# EAGLE design AT24-Timer (EAGLE 7.5.0)
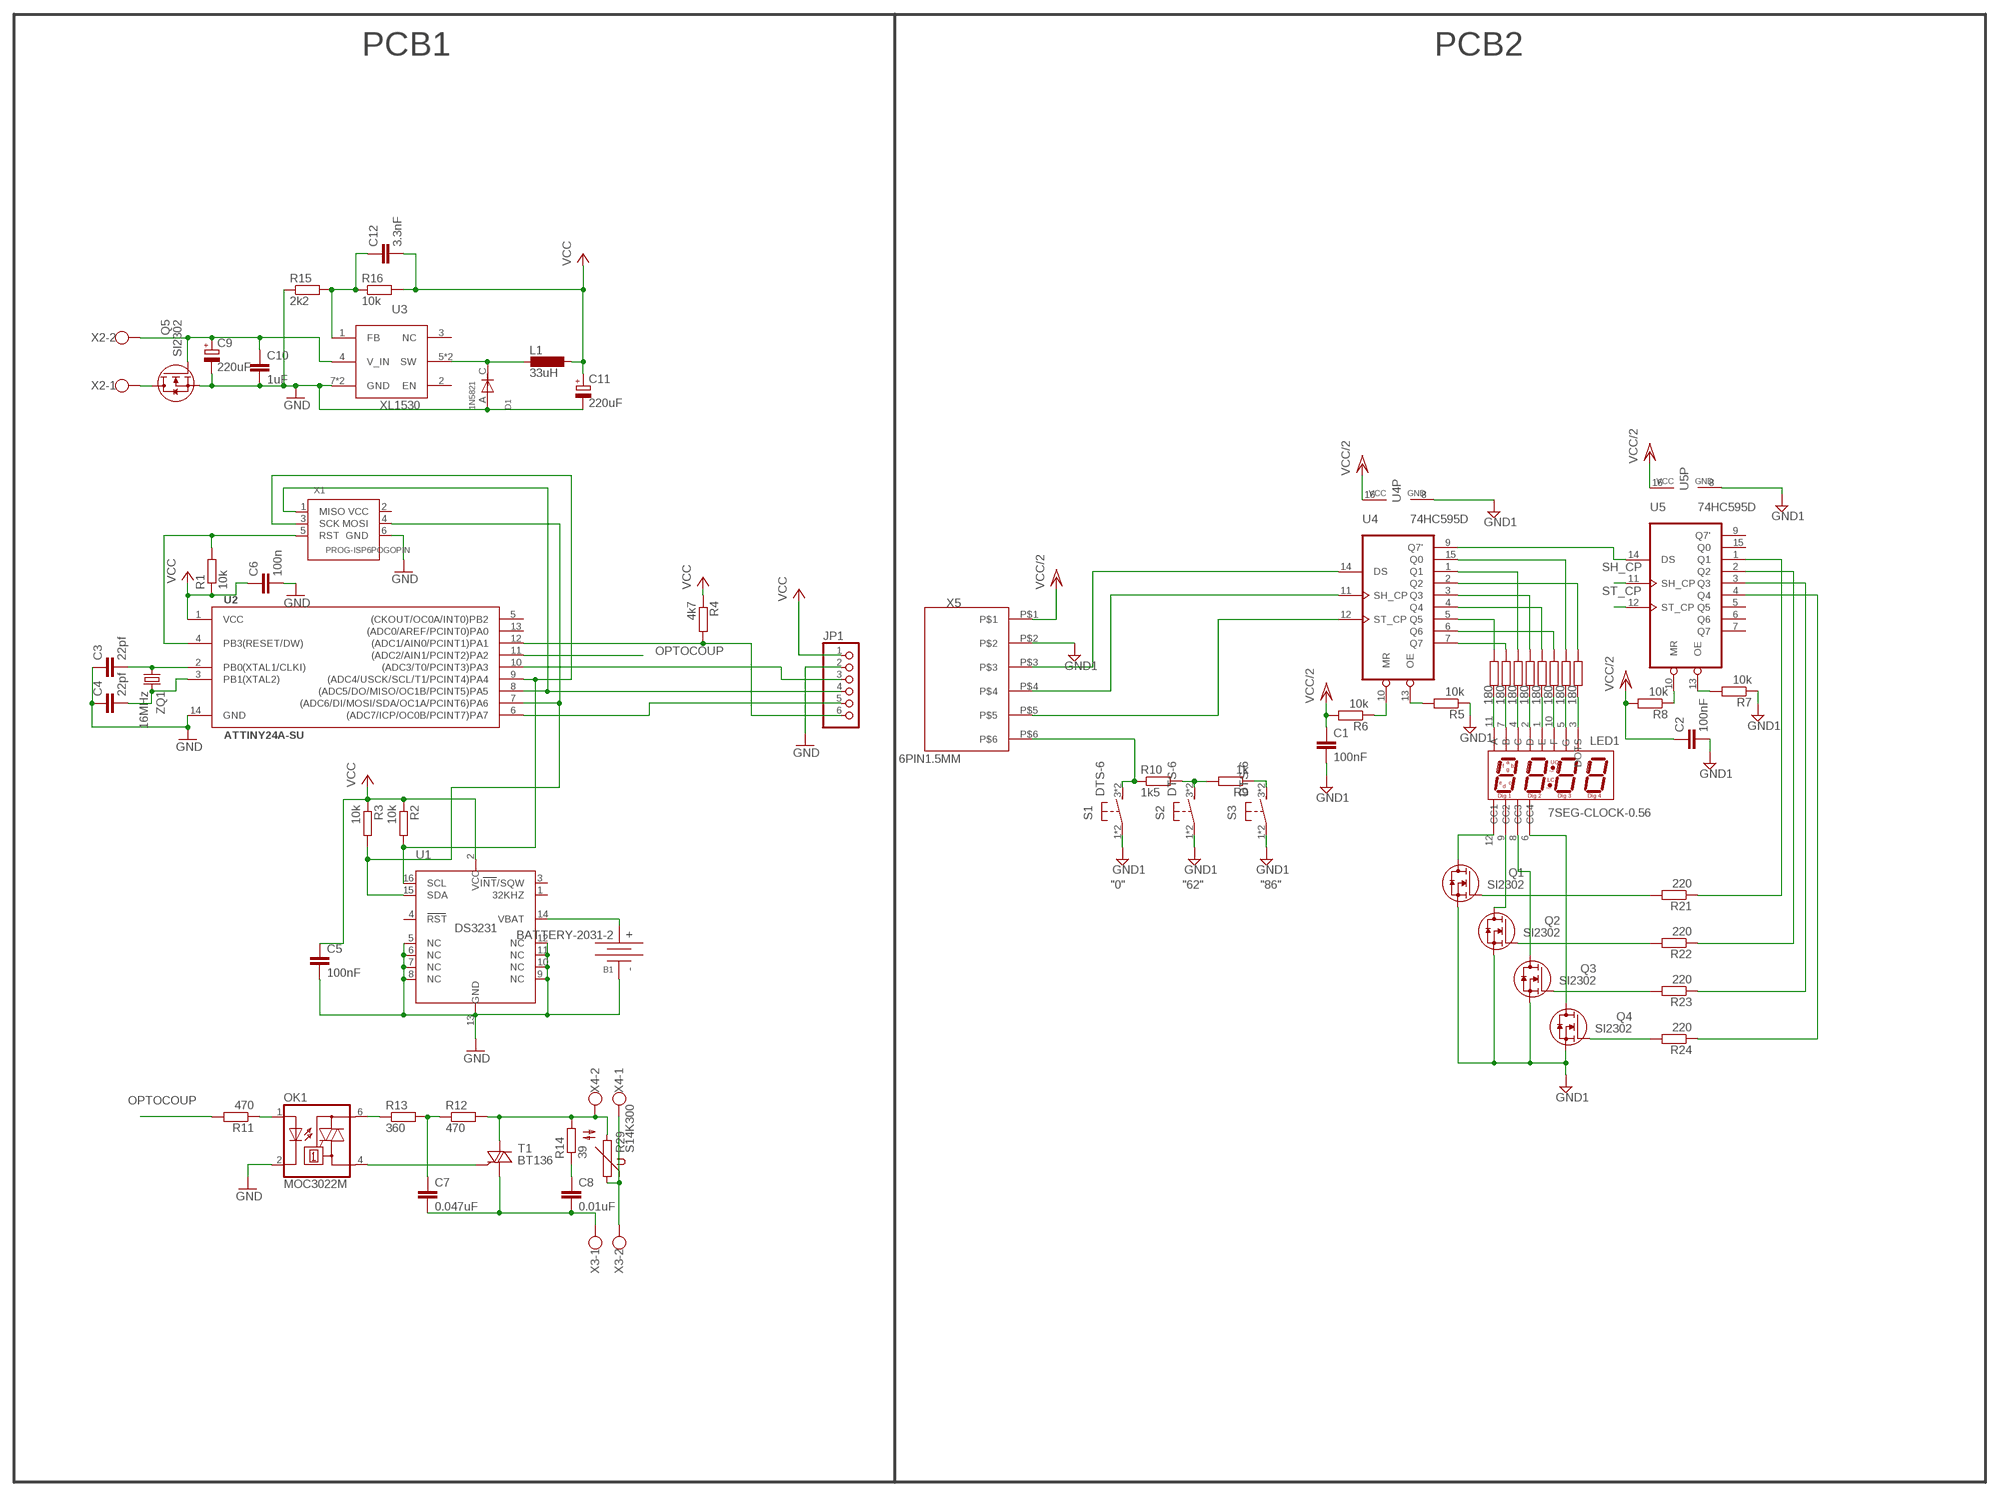
[diagram p0: schematic, sheet 1]

## Parts
B1  BATTERY-2031-2  [BTH2032-2]
C1  100nF  C-EUC0603  [C0603]
C2  100nF  C-EUC0603  [C0603]
C3  22pf  C-EUC0603  [C0603]
C4  22pf  C-EUC0603  [C0603]
C5  100nF  C-EUC0603  [C0603]
C6  100n  C-EUC0603  [C0603]
C7  0.047uF  C-EU150-054X183  [C150-054X183]
C8  0.01uF  C-EU102-043X133  [C102-043X133]
C9  220uF  CPOL-EUE2,5-6E  [E2,5-6E]
C10  1uF  C-EUC0805  [C0805]
C11  220uF  CPOL-EUE2,5-6E  [E2,5-6E]
C12  3.3nF  C-EUC0805  [C0805]
D1  1N5821  DIODESMD  [DO214AC]
JP1  PINHD-1X6  [1X06]
L1  33uH  L-SMD  [L-SMD-D10]
LED1  7SEG-CLOCK-0.56  [7SEG_4DIG_0.56]
OK1  MOC3022M  [DIL06]
Q1  SI2302  [SOT-23-GSD]
Q2  SI2302  [SOT-23-GSD]
Q3  SI2302  [SOT-23-GSD]
Q4  SI2302  [SOT-23-GSD]
Q5  SI2302  [SOT-23-GSD]
R1  10k  R-EU_R0805  [R0805]
R2  10k  R-EU_R0805  [R0805]
R3  10k  R-EU_R0805  [R0805]
R4  4k7  R-EU_R0805  [R0805]
R5  10k  R-EU_R0805  [R0805]
R6  10k  R-EU_R0805  [R0805]
R7  10k  R-EU_R0805  [R0805]
R8  10k  R-EU_R0805  [R0805]
R9  1k  R-EU_R0805  [R0805]
R10  1k5  R-EU_R0805  [R0805]
R11  470  R-EU_R0805  [R0805]
R12  470  R-EU_0207/7  [0207/7]
R13  360  R-EU_0207/7  [0207/7]
R14  39  R-EU_0207/7  [0207/7]
R15  2k2  R-EU_R0603  [R0603]
R16  10k  R-EU_R0603  [R0603]
R17  180  R-EU_R0805  [R0805]
R18  180  R-EU_R0805  [R0805]
R19  180  R-EU_R0805  [R0805]
R20  180  R-EU_R0805  [R0805]
R21  220  R-EU_R0805  [R0805]
R22  220  R-EU_R0805  [R0805]
R23  220  R-EU_R0805  [R0805]
R24  220  R-EU_R0805  [R0805]
R25  180  R-EU_R0805  [R0805]
R26  180  R-EU_R0805  [R0805]
R27  180  R-EU_R0805  [R0805]
R28  180  R-EU_R0805  [R0805]
R29  S14K300  [S14K300]
S1  DTS-6  [DTS-6]
S2  DTS-6  [DTS-6]
S3  DTS-6  [DTS-6]
T1  BT136  [TO220AB]
U1  DS3231  [SO16L]
U2  ATTINY24A-SU  [SO14]
U3  XL1530  [SOP08]
U4  74HC595D  [SO16]
U5  74HC595D  [SO16]
X1  PROG-ISP6POGOPIN  [PROG_POGOPIN]
X2  W237-102  [W237-102]
X3  W237-102  [W237-102]
X4  W237-102  [W237-102]
X5  6PIN1.5MM  [6PIN*1.5MM]
ZQ1  16MHz  CRYSTALHC49S  [HC49/S]

## Nets
GND: B1.- C3.1 C4.1 C5.2 C6.2 C9.- C10.2 C11.- D1.A(ANOD) JP1.2 OK1.2(C) Q5.S R15.1 U1.5(NC) U1.6(NC) U1.7(NC) U1.8(NC) U1.9(NC) U1.10(NC) U1.11(NC) U1.12(NC) U1.13(GND) U2.14(GND) U3.7(GND) U3.8(GND) X1.6(GND)
GND1: C1.2 C2.2 Q1.S Q2.S Q3.S Q4.S R5.1 R7.1 S1.1 S1.2 S2.1 S2.2 S3.1 S3.2 U4.8(GND) U5.8(GND) X5.P$2
N$1: R29.1 X3.2 X4.1
N$2: Q5.D X2.1
N$3: R3.2 U1.15(SDA) U2.7((ADC6/DI/MOSI/SDA/OC1A/PCINT6)PA6) X1.4(MOSI)
N$4: R2.2 U1.16(SCL) U2.9((ADC4/USCK/SCL/T1/PCINT4)PA4) X1.3(SCK)
N$5: R1.2 U2.4(PB3(RESET/DW)) X1.5(RST)
N$6: R10.1 S1.3 S1.4 X5.P$6
N$7: C3.2 U2.2(PB0(XTAL1/CLKI)) ZQ1.1
N$8: C4.2 U2.3(PB1(XTAL2)) ZQ1.2
N$9: R6.1 U4.10(MR)
N$10: JP1.6 R4.2 U2.12((ADC1/AIN0/PCINT1)PA1)
N$11: U4.14(DS) X5.P$3
N$12: C8.1 R14.1
N$13: C7.2 C8.2 T1.1(A1) X3.1
N$14: R12.2 R14.2 R29.2 T1.2(A2) X4.2
N$16: R9.1 S3.3 S3.4
N$17: OK1.4(A1) T1.3(G)
N$18: C7.1 R12.1 R13.2
N$19: OK1.6(A2) R13.1
N$20: R5.2 U4.13(OE)
N$21: OK1.1(A) R11.1
N$22: R8.1 U5.10(MR)
N$23: JP1.5 U2.6((ADC7/ICP/OC0B/PCINT7)PA7)
N$24: JP1.4 U2.8((ADC5/DO/MISO/OC1B/PCINT5)PA5) X1.1(MISO)
N$25: R7.2 U5.13(OE)
N$27: JP1.3 U2.10((ADC3/T0/PCINT3)PA3)
N$28: R17.1 U4.5(Q5)
N$29: R18.1 U4.7(Q7)
N$30: U4.9(Q7') U5.14(DS)
N$31: R19.1 U4.1(Q1)
N$32: R20.1 U4.3(Q3)
N$33: R25.1 U4.4(Q4)
N$34: R26.1 U4.6(Q6)
N$35: R27.1 U4.15(Q0)
N$36: R28.1 U4.2(Q2)
N$37: LED1.12(CC1) Q1.D
N$38: LED1.9(CC2) Q2.D
N$39: LED1.8(CC3) Q3.D
N$40: LED1.6(CC4) Q4.D
N$41: R21.1 U5.1(Q1)
N$42: R22.1 U5.2(Q2)
N$43: R23.1 U5.3(Q3)
N$44: R24.1 U5.4(Q4)
N$49: C9.+ C10.1 Q5.G U3.4(V_IN) X2.2
N$51: LED1.11(A) R17.2
N$52: LED1.7(B) R18.2
N$53: C12.1 R15.2 R16.1 U3.1(FB)
N$54: D1.C(KATOD) L1.P$2 U3.5(SW) U3.6(SW)
N$55: LED1.4(C) R19.2
N$56: B1.+ U1.14(VBAT)
N$57: LED1.2(D) R20.2
N$58: LED1.1(E) R25.2
N$59: LED1.10(F) R26.2
N$60: LED1.5(G) R27.2
N$61: LED1.3(DOTS) R28.2
N$65: Q4.G R24.2
N$66: Q3.G R23.2
N$67: Q2.G R22.2
N$68: Q1.G R21.2
N$160: R9.2 R10.2 S2.3 S2.4
OPTOCOUP: R11.2 U2.11((ADC2/AIN1/PCINT2)PA2)
SH_CP: U4.11(SH_CP) U5.11(SH_CP) X5.P$4
ST_CP: U4.12(ST_CP) U5.12(ST_CP) X5.P$5
VCC: C5.1 C6.1 C11.+ C12.2 JP1.1 L1.P$1 R1.1 R2.1 R3.1 R4.1 R16.2 U1.2(VCC) U2.1(VCC)
VCC/2: C1.1 C2.1 R6.2 R8.2 U4.16(VCC) U5.16(VCC) X5.P$1
Unconnected: U1.1(32KHZ) U1.3(INT/SQW) U1.4(RST) U2.5((CKOUT/OC0A/INT0)PB2) U2.13((ADC0/AREF/PCINT0)PA0) U3.2(EN) U3.3(NC) U5.5(Q5) U5.6(Q6) U5.7(Q7) U5.9(Q7') U5.15(Q0) X1.2(VCC)

## Notes on the sheet
- PCB1 | PCB2
- "0" | "62" | "86"

## Library data of the parts
B1 = usb:BATTERY
C1-C8 C10 C12 = rcl:C-EU: CAPACITOR, European symbol
C9 C11 = rcl:CPOL-EU: POLARIZED CAPACITOR, European symbol
D1 = usb:DIODE: DIODE
JP1 = pinhead:PINHD-1X6: PIN HEADER
L1 = usb:L-SMD
LED1 = usb:7SEG-CLOCK-0.56
OK1 = optocoupler:MOC30*M: RANDOM-PHASE OPTOISOLATORS TRIAC DRIVER OUTPUT Source: http://www.fairchildsemi.com MOC3020-M.pdf; MF: FAIRCHILD SEMICONDUCTOR; MPN: MOC3022-M; OC_FARNELL: 1021086; OC_NEWARK: 58K1956
Q1-Q5 = usb:SI2302: N-канальный полевик
R1-R28 = rcl:R-EU_: RESISTOR, European symbol
R29 = varistor:S14K300: VARISTOR
S1-S3 = switch-tact:DTS-6
T1 = triac:BT136: Triac BT136 series E sensitive gate Source: http://www.nxp.com/acrobat_download/datasheets/BT136_SERIES_E_2.pdf
U1 = usb:DS3231: Real-Time Clock DS3231
U2 = usb:ATTINY24A: ATTiny24A ATTiny44A ATTiny84A
U3 = usb:XL1530
U4 U5 = 74xx-eu:74*595: 8-bit SHIFT REGISTER, output latch
X1 = usb:PROG-ISP
X2-X4 = con-wago-500:W237-102: WAGO SCREW CLAMP; MPN: 237-102; OC_FARNELL: unknown; OC_NEWARK: 70K9898
X5 = usb:6PIN*1.5MM
ZQ1 = crystal:CRYSTAL: CRYSTAL; OC_FARNELL: 1667008; OC_NEWARK: unknown

## Board
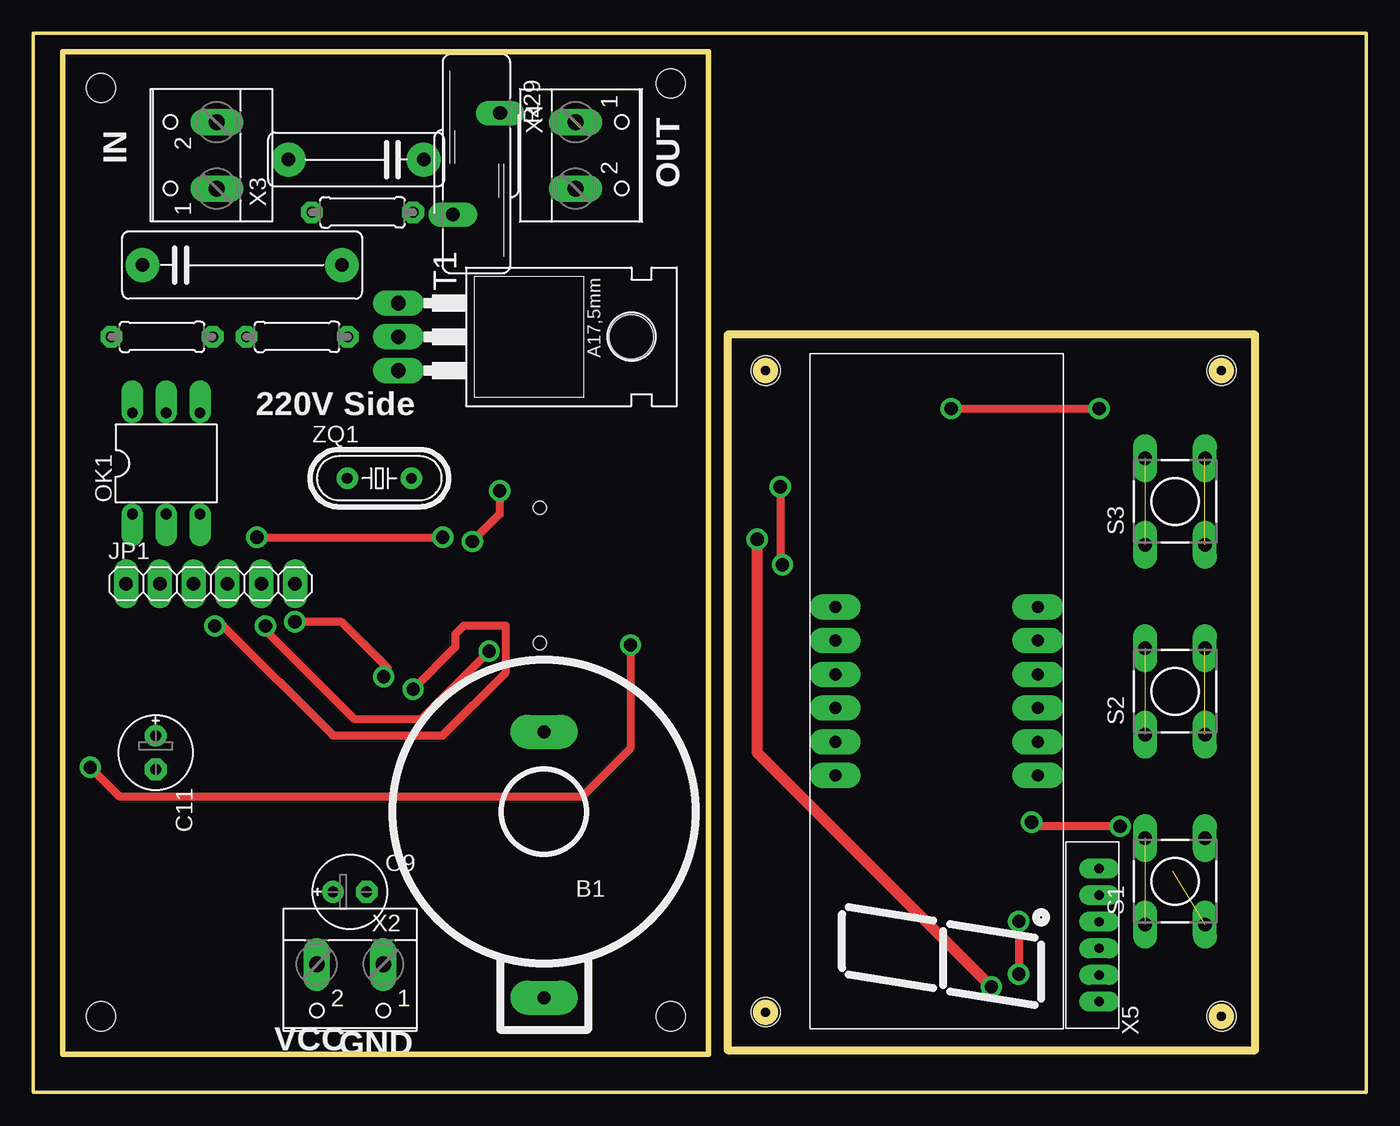
[diagram p1: board, top side]
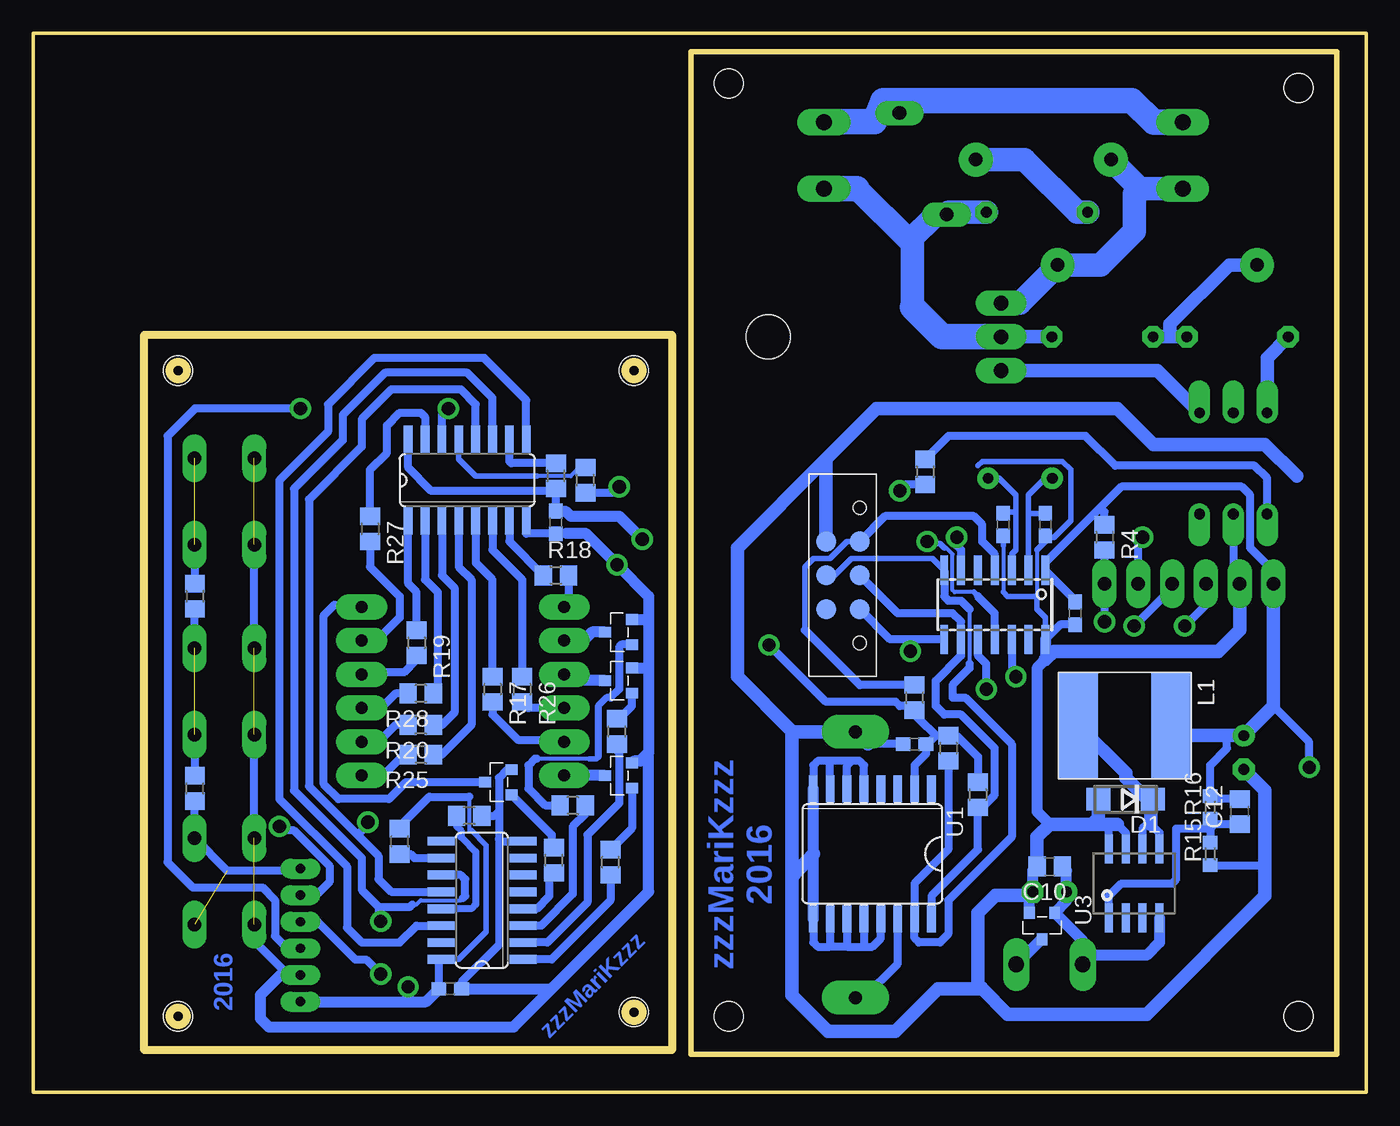
[diagram p2: board, bottom side, seen from below]

Size 100.27 x 79.67 mm. Coordinates in mm from the lower left corner, seen from the top.
Outline: 0,0 100.27,0 100.27,79.67 0,79.67 0,0
Outline: 2.22,2.86 50.8,2.86 50.8,78.26 2.22,78.26 2.22,2.86
Outline: 91.92,3.17 91.92,56.99 52.23,56.99 52.23,3.17 91.92,3.17
Outline: circle at 89.38,5.71 radius 0.64
Outline: circle at 55.09,6.03 radius 0.64
Outline: circle at 55.09,54.29 radius 0.64
Outline: circle at 89.38,54.29 radius 0.64
Copper layers (1*16): Top 0.035mm / dielectric 1.5mm / Bottom 0.035mm
Design rules "default *": minimum track width 12mil, minimum drill 20mil, track to track 12mil, track to pad 12mil, pad to pad 12mil, via to via 12mil, smd to smd 8mil, copper to edge 20mil, drill to drill 8mil, minimum pad ring 16mil, minimum via ring 12mil, stop-mask expansion 4mil, vias tented up to drill 0mil, thermal gap 20mil
Holes 2.2 mm at 5.08,5.71 47.94,5.71 47.94,75.88 5.08,75.56 55.09,6.03 55.09,54.29 89.38,54.29 89.38,5.71

### Footprints (pad centres in the part's own frame; a part is rotated, then mirrored left to right if it is on the bottom)
BTH2032-2 = drill 1 pad 2.54 long: + 0,-14; - 0,6
C0603 = smd 1.1 x 1: 1 -0.85,0; 2 0.85,0
C150-054X183 = drill 1.016 pad 2.54: 1 -7.493,0; 2 7.493,0
C102-043X133 = drill 1.016 pad 2.54: 1 -5.08,0; 2 5.08,0
E2,5-6E = drill 0.813 pad 1.575: + -1.27,0 | drill 0.813 pad 1.575 octagon: - 1.27,0
C0805 = smd 1.3 x 1.5: 1 -0.95,0; 2 0.95,0
DO214AC = smd 1.8 x 1.7: A 2.05,0; C -2.05,0
1X06 = drill 1.016 long: 1 -6.35,0; 2 -3.81,0; 3 -1.27,0; 4 1.27,0; 5 3.81,0; 6 6.35,0
L-SMD-D10 = smd 8 x 3: P$1 4,8.5; P$2 4,1.5
7SEG_4DIG_0.56 = drill 0.9 pad 1.93 long: 1 -5.08,-2.54; 2 -2.54,-2.54; 3 0,-2.54; 4 2.54,-2.54; 5 5.08,-2.54; 6 7.62,-2.54; 7 7.62,12.7; 8 5.08,12.7; 9 2.54,12.7; 10 0,12.7; 11 -2.54,12.7; 12 -5.08,12.7
DIL06 = drill 0.813 offset: 1 -2.54,-3.81; 2 0,-3.81; 3 2.54,-3.81; 4 2.54,3.81; 5 0,3.81; 6 -2.54,3.81
SOT-23-GSD = smd 0.8 x 0.9: D 0,2; G -0.95,0; S 0.95,0
R0805 = smd 1.3 x 1.5: 1 -0.95,0; 2 0.95,0
0207/7 = drill 0.813 octagon: 1 -3.81,0; 2 3.81,0
R0603 = smd 1 x 1.1: 1 -0.85,0; 2 0.85,0
S14K300 = drill 1.016 long: 1 -1.778,-3.81; 2 1.778,3.81
DTS-6 = drill 1 long: 1 -3.25,2.25; 2 3.25,2.25; 3 -3.25,-2.25; 4 3.25,-2.25
TO220AB = drill 1.118 long: 1 -2.54,-6.35; 2 0,-6.35; 3 2.54,-6.35 | hole 3.302: 0,11.176
SO16L = smd 0.66 x 2.032: 1 -4.445,-4.902; 2 -3.175,-4.902; 3 -1.905,-4.902; 4 -0.635,-4.902; 5 0.635,-4.902; 6 1.905,-4.902; 7 3.175,-4.902; 8 4.445,-4.902; 9 4.445,4.902; 10 3.175,4.902; 11 1.905,4.902; 12 0.635,4.902; 13 -0.635,4.902; 14 -1.905,4.902; 15 -3.175,4.902; 16 -4.445,4.902
SO14 = smd 0.6 x 2.2: 1 -3.81,-2.6; 2 -2.54,-2.6; 3 -1.27,-2.6; 4 0,-2.6; 5 1.27,-2.6; 6 2.54,-2.6; 7 3.81,-2.6; 8 3.81,2.6; 9 2.54,2.6; 10 1.27,2.6; 11 0,2.6; 12 -1.27,2.6; 13 -2.54,2.6; 14 -3.81,2.6
SOP08 = smd 0.6 x 2.2: 1 -1.905,-2.6; 2 -0.635,-2.6; 3 0.635,-2.6; 4 1.905,-2.6; 5 1.905,2.6; 6 0.635,2.6; 7 -0.635,2.6; 8 -1.905,2.6
SO16 = smd 0.66 x 2.032: 1 -4.445,-3.073; 2 -3.175,-3.073; 3 -1.905,-3.073; 4 -0.635,-3.073; 5 0.635,-3.073; 6 1.905,-3.073; 7 3.175,-3.073; 8 4.445,-3.073; 9 4.445,3.073; 10 3.175,3.073; 11 1.905,3.073; 12 0.635,3.073; 13 -0.635,3.073; 14 -1.905,3.073; 15 -3.175,3.073; 16 -4.445,3.073
PROG_POGOPIN = smd 1.524 x 1.524: 1 0,7.62; 2 2.54,7.62; 3 0,5.08; 4 2.54,5.08; 5 0,2.54; 6 2.54,2.54 | hole 1.016: 0,0; 0,10.16
W237-102 = drill 1.194 long: 1 -2.5,-1.27; 2 2.5,-1.27
6PIN*1.5MM = drill 0.7 long: P$1 0,0; P$2 0,2; P$3 0,4; P$4 0,6; P$5 0,8; P$6 0,10
HC49/S = drill 0.813: 1 -2.413,0; 2 2.413,0

### Placement (x,y rotation side)
B1  38.42,21.11 0 top
C1  68.9,7.79 0 bottom
C2  60.96,42.88 270 bottom
C3  24.13,42.7 90 bottom
C4  27.3,42.7 90 bottom
C5  33.97,26.19 180 bottom
C6  21.91,36.04 270 bottom
C7  15.72,62.23 0 top
C8  24.29,70.17 180 top
C9  23.81,15.08 0 top
C10  23.81,16.99 180 bottom
C11  9.21,25.56 270 top
C12  9.53,21.11 90 bottom
D1  18.1,22.07 180 bottom
JP1  13.34,38.26 0 top
L1  23.18,31.59 270 bottom
LED1  73.03,28.91 90 top
OK1  10,47.31 0 top
Q1  55.24,23.83 90 bottom
Q2  55.24,30.97 90 bottom
Q3  55.24,34.62 90 bottom
Q4  64.29,23.32 90 bottom
Q5  24.39,13.51 180 bottom
R1  33.97,29.69 90 bottom
R2  29.21,22.38 270 bottom
R3  31.43,25.88 270 bottom
R4  19.68,41.75 270 bottom
R5  58.74,46.05 90 bottom
R6  60.96,46.37 270 bottom
R7  67.47,20.81 180 bottom
R8  72.71,18.88 90 bottom
R9  88.11,37.31 270 bottom
R10  88.11,22.86 90 bottom
R11  33.18,46.67 270 bottom
R12  19.84,56.83 0 top
R13  9.68,56.83 0 top
R14  24.77,66.2 0 top
R15  11.75,17.94 90 bottom
R16  11.75,21.43 90 bottom
R17  65.72,30.32 270 bottom
R18  60.96,38.89 0 bottom
R19  71.44,33.81 270 bottom
R20  71.12,27.62 180 bottom
R21  56.85,17.3 90 bottom
R22  56.37,27.15 90 bottom
R23  59.69,21.58 180 bottom
R24  61.1,17.46 90 bottom
R25  71.12,25.4 180 bottom
R26  63.5,30.32 270 bottom
R27  74.93,42.39 270 bottom
R28  71.12,30 180 bottom
R29  33.34,69.85 180 top
S1  85.88,15.88 90 top
S2  85.88,30.16 90 top
S3  85.88,44.45 90 top
T1  33.81,56.83 270 top
U1  37.15,17.94 180 bottom
U2  27.94,36.67 180 bottom
U3  17.46,15.72 0 bottom
U4  67.63,46.05 0 bottom
U5  66.52,14.45 90 bottom
X1  38.1,43.97 180 bottom
X2  23.83,8.35 180 top
X3  12.54,70.48 90 top
X4  42.07,70.48 270 top
X5  80.17,6.83 0 top
ZQ1  26.04,46.2 0 top

### Tracks (layer width: path | path; a pad name or v marks a point on that pad's centre or on a via)
GND
  Bottom 0.254: 23.81,41.75 24.03,41.75 C3.1
  Bottom 0.305: 24.77,40.8 24.77,37.31 | 27.3,41.12 27.3,37.62
  Bottom 0.406: C3.1 24.13,41.43 24.77,40.8 | U2.14 24.13,35.72 24.77,36.35 24.77,37.31 26.99,37.31 27.3,37.62 | C4.1 27.3,41.12 | 23.81,41.75 23.5,41.75 22.23,43.02 22.23,46.83 22.86,47.47 28.89,47.47 29.21,47.15 | 41.59,17.94 41.59,17.74
  Bottom 0.61: C6.2 23.02,35.19 U2.14 | 18.73,20.16 18.1,19.53 U3.7 | U3.8 19.37,20.16 | R15.1 7.83,17.09 7.62,17.3 | U1.11 39.05,10.95 | 39.05,10.95 37.78,10.95 | 37.78,10.95 37.15,10.95 36.51,11.59 U1.13 | U1.9 41.59,11.27 41.27,10.95 40.32,10.95 | U1.10 40.32,10.95 | U1.12 37.78,10.95 | U1.5 37.78,24.61 38.1,24.92 38.73,24.92 | 38.73,24.92 40.32,24.92 | 40.32,24.92 41.27,24.92 41.59,24.61 U1.8 | U1.7 40.32,24.92 | U1.6 39.05,24.61 38.73,24.92 | C5.2 37.5,26.19 | 39.05,10.95 40.32,10.95 | OK1.2 10,38.73 JP1.2
  Bottom 0.813: Q5.S 25.34,14.82 C9.- 25.08,16.67 C10.2 | U2.14 24.13,32.54 24.77,31.91 24.77,21.11 23.81,20.16 | 41.59,17.94 U1.8 | U1.9 41.59,17.74 41.69,17.84
  Bottom 1.016: C10.2 24.76,19.21 23.81,20.16 20.64,20.16 | 20.64,20.16 19.37,20.16 18.73,20.16 | D1.A 20.15,20.65 20.64,20.16 | 25.34,14.82 27.88,14.82 29.21,13.49 29.21,8.1 28.89,7.78 | 28.89,7.78 26.99,5.87 16.51,5.87 7.62,14.76 7.62,17.3 7.62,22.7 C11.- | JP1.2 9.53,34.77 11.11,33.18 23.5,33.18 24.13,32.54 | X1.6 40.64,47.62 | 40.64,47.62 36.83,51.44 18.73,51.44 16.03,48.74 7.62,48.74 5.24,46.35 | 43.15,27.11 B1.- 37.5,26.19 | 43.15,27.11 47.31,31.27 47.31,40.96 40.64,47.62 | 28.89,7.78 32.23,7.78 35.4,4.6 40.48,4.6 43.18,7.3 43.18,16.19 | 43.18,16.19 43.18,27.08 43.15,27.11 | 43.18,16.19 41.59,17.94
GND1  (via drill 1)  (3 unrouted)
  Top 0.61: v56.2,45.56 56.2,39.85 v56.36,39.69
  Bottom 0.61: U4.8 63.18,42.03 C2.2 60.92,42.07 60.17,42.07 | C1.2 68.05,8.31 65.25,11.11 65.25,19.05 | Q4.S 64.63,24.27 65.25,23.65 65.25,21.11 | 65.25,21.11 65.25,19.05 | R5.1 56.66,45.1 v56.2,45.56 | 65.25,19.05 65.09,18.89 U5.8 | R7.1 65.55,20.81 65.25,21.11 | S2.2 S3.1 | S1.2 S2.1 | S1.1 83.63,11.4 81.12,8.89 80.23,8.89 X5.P$2
  Bottom 0.813: Q3.S 54.15,35.57 53.98,35.4 | 53.98,35.4 53.98,31.27 | 53.98,31.27 53.98,25.56 | 53.98,25.56 54.61,24.92 55.1,24.92 Q1.S | Q2.S 53.99,31.92 53.98,31.27 | 60.17,42.07 58.74,42.07 v56.36,39.69 53.98,37.31 53.98,35.4 | C1.2 61.26,7.79 | 61.26,7.79 53.98,15.08 53.98,25.56 | X5.P$2 81.66,8.83 83.19,7.3 83.19,5.56 82.55,4.92 64.14,4.92 61.26,7.79
N$1
  Bottom 0.406: 39.49,73.03 39.81,73.03 X4.1
  Bottom 1.778: R29.1 35.12,73.85 35.88,74.61
  Bottom 1.93: X3.2 15.99,72.98 17.62,74.61 35.88,74.61 36.35,74.61 36.99,73.03 39.49,73.03
N$2
  Bottom 0.813: Q5.D 24.44,11.51 X2.1
N$3
  Bottom 0.305: 29.84,36.35 29.84,32.23
  Bottom 0.406: U2.7 32.64,40.16 38.73,40.16 40.01,38.89 X1.4
  Bottom 0.61: R3.2 31.43,18.26 33.97,15.72 U1.15 33.97,11.59 33.66,11.27 32.07,11.27 31.43,11.91 31.43,14.45 26.67,19.21 26.67,26.19 30.16,29.69 31.11,29.69 31.11,30.64 29.84,31.91 29.84,32.23 | 29.84,36.35 30.48,36.99 31.43,36.99 31.75,37.31 U2.7
N$4
  Bottom 0.61: U1.16 32.7,14.76 29.21,18.26 R2.2 28.89,21.43 27.94,22.38 27.94,25.88 30.48,28.42 31.75,28.42 32.38,29.05 32.38,30.96 30.48,32.86 U2.9 30.48,35.4 31.11,36.04 35.24,36.04 X1.3
N$5
  Bottom 0.406: 42.23,34.77 42.23,39.53 41.59,40.16 40.32,40.16 39.05,41.43 X1.5 | U2.4 27.94,40.48
  Bottom 0.61: R1.2 38.1,30.64 42.23,34.77 | 27.94,40.48 28.89,41.43 28.89,42.7 29.53,43.34 36.2,43.34 X1.5
N$6  (1 unrouted)
  Bottom 0.61: R10.1 88.13,21.91 S1.4 85.68,16.67 80.33,16.67 X5.P$6
N$7
  Bottom 0.406: ZQ1.1 24.13,46.2 25.4,44.93 25.4,43.66 | 25.4,43.66 U2.2 | C3.2 25.3,43.55 25.4,43.66
N$8
  Bottom 0.406: ZQ1.2 27.62,46.2 26.35,44.93 26.35,43.66 | 26.35,43.66 26.35,40.8 26.67,40.48 U2.3 | C4.2 27.3,43.66 26.35,43.66
N$9
  Bottom 0.61: R6.1 64.31,47.32 64.45,47.47 U4.10
N$10  (via drill 1)
  Top 0.61: v19.68,35.4 23.18,35.4 26.67,31.91 26.67,31.59 v26.35,31.27
  Bottom 0.61: R4.2 JP1.6 v19.68,35.4 | U2.12 26.67,31.59 v26.35,31.27
N$11  (via drill 1)
  Top 0.61: v69.06,51.44 v80.17,51.44
  Bottom 0.61: U4.14 69.53,50.96 v69.06,51.44 | v80.17,51.44 88.11,51.44 90.17,49.37 90.17,17.3 88.27,15.4 83.03,15.4 82.07,14.45 82.07,11.75 81.12,10.79 80.2,10.79 X5.P$3
N$12
  Bottom 1.778: R14.1 21.75,66.2 25.72,70.17 C8.1
N$13
  Bottom 1.016: C7.2 23.34,62.23
  Bottom 1.778: T1.1 26.07,59.37 C7.2 20,62.23 17.46,64.77 17.46,67.55 17.03,67.98 | X3.1 17.03,67.98 | 17.03,67.98 C8.2
N$14
  Bottom 1.016: R12.2 T1.2
  Bottom 1.778: 34.13,59.05 34.13,63.82 34.37,64.06 | 34.37,64.06 38.3,67.98 | 34.37,64.06 32.38,66.04 R29.2 31.4,66.2 R14.2
  Bottom 1.93: T1.2 31.91,56.83 34.13,59.05 | X4.2 38.3,67.98
N$16  (1 unrouted)
  Bottom 0.61: S3.3 88.13,38.26 R9.1
N$17
  Bottom 1.016: OK1.4 15.72,54.29 T1.3
N$18
  Bottom 1.016: R12.1 15.08,56.83 | 15.08,56.83 R13.2 | C7.1 10.32,62.23 14.76,57.78 14.76,57.15 15.08,56.83
N$19
  Bottom 1.016: OK1.6 7.46,55.24 R13.1
N$20
  Bottom 0.305: R5.2 59.2,47 59.85,46.35 62.39,46.35
  Bottom 0.406: 62.39,46.35 66.99,46.35 68.26,47.62 U4.13
N$21
  Bottom 0.61: OK1.1 7.46,46.2 8.41,47.15 18.89,47.15 21.11,49.37 31.43,49.37 R11.1
N$22
  Bottom 0.61: R8.1 71.9,17.93 71.6,17.62 U5.10
N$23  (via drill 1)
  Top 0.61: v16.83,41.75 v30.8,41.75
  Bottom 0.61: JP1.5 17.14,41.43 v16.83,41.75 | v30.8,41.75 30.8,41.12 30.48,40.8 U2.6
N$24  (via drill 1)
  Top 0.61: v17.46,35.08 17.46,34.77 24.13,28.1 29.21,28.1 v34.29,33.18
  Bottom 0.61: U2.8 34.61,34.07 | 34.61,34.07 35.82,34.07 X1.1 | JP1.4 14.61,37.94 v17.46,35.08 | v34.29,33.18 34.29,33.75 34.61,34.07
N$25
  Bottom 0.508: R7.2 68.42,20 68.1,19.68 68.1,19.21 66.99,18.1 66.99,14.13 67.31,13.81 U5.13
N$27  (via drill 1)
  Top 0.61: v13.65,35.08 14.29,35.08 22.54,26.83 30.8,26.83 35.56,31.59 35.56,35.08 32.38,35.08 31.75,34.45 31.75,33.5 v28.57,30.32
  Bottom 0.61: JP1.3 12.06,36.67 v13.65,35.08 | v28.57,30.32 28.57,32.23 29.21,32.86 U2.10
N$28
  Bottom 0.61: U4.5 66.99,39.85 65.72,38.58 R17.1
N$29
  Bottom 0.61: U4.7 64.45,41.44 R18.1
N$30
  Bottom 0.61: U4.9 63.18,52.07 66.36,55.24 74.61,55.24 78.11,51.75 78.11,49.69 81.76,46.04 81.76,22.07 76.68,16.99 76.68,12.38 75.56,11.27 72.71,11.27 71.44,12.54 U5.14
N$31
  Bottom 0.61: R19.1 71.44,37.62 72.07,38.26 U4.1
N$32
  Bottom 0.61: U4.3 69.53,38.89 68.58,37.94 68.58,28.57 69.53,27.62 R20.1
N$33
  Bottom 0.61: U4.4 68.26,39.53 67.31,38.58 67.31,27.62 69.53,25.4 R25.1
N$34
  Bottom 0.61: U4.6 65.72,40.8 63.5,38.58 R26.1
N$35
  Bottom 0.61: R27.1 74.93,46.83 73.66,48.1 73.66,50.16 72.71,51.12 71.12,51.12 70.8,50.8 U4.15
N$36
  Bottom 0.61: U4.2 70.8,38.58 69.85,37.62 69.85,30.32 R28.1
N$37
  Bottom 0.813: Q1.D LED1.12
N$38
  Bottom 0.813: Q2.D 59.85,30.97 LED1.9
N$39
  Bottom 0.813: Q3.D 58.25,34.62 58.74,34.13 60.18,34.13 LED1.8
N$40
  Bottom 0.61: LED1.6 75.71,36.67 77.63,36.67 78.42,35.88 78.42,23.18 77.31,22.07 73.5,22.07 72.25,23.32 Q4.D
N$41
  Bottom 0.61: R21.1 56.85,14.43 61.28,10 U5.1
N$42
  Bottom 0.61: R22.1 56.37,25.73 56.2,25.56 56.2,21.75 58.58,19.37 58.58,14.29 61.59,11.27 U5.2
N$43
  Bottom 0.61: R23.1 58.74,20.95 59.69,20 59.69,14.92 62.07,12.54 U5.3
N$44
  Bottom 0.61: U5.4 62.39,13.81 61.44,14.76 61.44,16.18 R24.1
N$49
  Bottom 0.813: C10.1 22.54,16.67 C9.+ 22.54,14.41 Q5.G 21.33,11.4 X2.2 20.63,10.32 16.51,10.32 15.56,11.27 U3.4
N$51
  Bottom 0.61: R17.2 65.72,28.42 63.82,26.51 60.47,26.51 LED1.11
N$52
  Bottom 0.61: R18.2 60.01,36.84 LED1.7
N$53
  Bottom 0.61: R16.1 11.75,19.84 | 11.75,19.84 R15.2 | U3.1 19.37,14.76 18.41,15.72 14.61,15.72 14.29,16.03 14.29,19.84 11.75,19.84 | C12.1 11.43,20.16 11.75,19.84
N$54
  Bottom 0.61: U3.5 15.56,19.53 16.19,20.16 16.51,20.16 16.83,19.84 U3.6
  Bottom 1.016: 16.19,20.16 16.19,21.92 D1.C 16.51,22.07 18.1,23.65 18.1,24.01 L1.P$2
N$55
  Bottom 0.61: R19.2 71.44,32.54 72.39,31.59 75.42,31.59 LED1.4
N$56
  Bottom 0.61: B1.+ 37.81,7.11 35.24,9.68 U1.14
N$57
  Bottom 0.61: R20.2 73.03,27.62 74.3,26.35 75.55,26.35 LED1.2
N$58
  Bottom 0.61: R25.2 72.39,25.4 73.98,23.81 75.55,23.81 LED1.1
N$59
  Bottom 0.61: LED1.10 63.03,28.91 R26.2
N$60
  Bottom 0.61: R27.2 74.93,39.53 72.71,37.31 72.71,35.72 74.61,33.81 75.39,33.81 LED1.5
N$61
  Bottom 0.61: R28.2 73.03,30 74.14,28.89 75.55,28.89 LED1.3
N$65
  Bottom 0.61: Q4.G 61.28,19.37 61.28,18.59 R24.2
N$66
  Bottom 0.305: 58.42,25.08 62.39,25.08
  Bottom 0.406: 57.78,25.24 57.94,25.08 58.42,25.08
  Bottom 0.508: 56.83,29.69 57.15,29.69 57.78,29.05 57.78,25.24
  Bottom 0.61: Q3.G 56.02,33.67 56.2,33.5 56.2,30.32 56.83,29.69 | 62.39,25.08 62.55,25.08 63.02,24.61 63.02,22.86 61.75,21.59 60.65,21.59 R23.2
N$67
  Bottom 0.61: R22.2 56.2,28.1 55.24,29.05 Q2.G
N$68
  Bottom 0.61: Q1.G 55.24,19.86 R21.2
N$160  (1 unrouted)
  Bottom 0.61: R10.2 88.11,26.91 S2.3 | S2.4 88.13,36.36 R9.2
OPTOCOUP  (via drill 1)
  Top 0.61: v35.08,45.24 35.08,43.5 v33.02,41.43
  Bottom 0.305: 29.53,37.62 30.96,37.62 31.11,37.78 31.11,40.48 31.59,40.96 31.75,40.96
  Bottom 0.406: 29.21,37.31 29.53,37.62 | 31.75,40.96 32.07,41.27 32.86,41.27 v33.02,41.43
  Bottom 0.61: U2.11 27.94,36.04 29.21,37.31 | R11.2 34.6,45.72 v35.08,45.24
SH_CP  (via drill 1)
  Top 0.61: v74.14,12.86 v74.14,8.89
  Bottom 0.305: 71.75,14.13 71.44,14.13 71.12,14.45 68.1,14.45 67.94,14.61
  Bottom 0.61: U4.11 65.72,52.23 67.63,54.13 73.82,54.13 76.99,50.96 76.99,49.05 80.64,45.4 80.64,22.7 75.56,17.62 75.56,15.24 74.3,13.97 | 74.3,13.97 71.91,13.97 71.75,14.13 | 67.94,14.61 67.79,14.76 67.79,16.03 68.1,16.35 U5.11 | 74.3,13.97 74.3,13.02 v74.14,12.86 | v74.14,8.89 75.25,10 76.04,10 78.87,12.83 X5.P$4
ST_CP  (via drill 1)
  Top 0.61: v81.76,20 75.41,20 v75.09,20.32
  Bottom 0.61: U4.12 66.99,51.75 68.1,52.86 73.34,52.86 75.56,50.64 75.56,48.58 79.53,44.61 79.53,23.02 75.88,19.37 | U5.12 73.34,15.08 74.3,16.03 74.3,17.78 75.88,19.37 | 75.88,19.37 75.09,20.16 v75.09,20.32 | X5.P$5 79,14.83 77.95,15.88 77.95,16.99 80.64,19.68 81.44,19.68 v81.76,20
VCC  (via drill 1)
  Top 0.61: v44.93,33.66 44.93,25.88 41.27,22.23 6.51,22.23 v4.29,24.45
  Bottom 0.61: 10.79,26.83 10.48,26.51 10.48,25.88 11.75,24.61 R16.2 11.53,22.06 C12.2 | U1.2 33.97,24.61 33.12,25.46 C5.1 33.02,26.19 32.38,26.83 | 32.38,26.83 R3.1 | R1.1 33.97,28.42 33.66,28.1 | 33.66,28.1 32.38,26.83 | 20,43.97 24.13,39.85 U2.1 21.91,37.05 C6.1 | R4.1 19.68,43.66 20,43.97 | R3.1 30.8,26.83 29.21,25.24 R2.1 | JP1.1 6.99,39.21 8.73,40.96 8.73,44.93 9.37,45.56 18.41,45.56 20,43.97 | R3.1 32.38,26.83 | 33.66,28.1 33.66,28.42 34.29,29.05 35.08,29.05 35.4,29.37 40.64,29.37 v44.93,33.66 | v4.29,24.45 4.29,26.35 6.99,29.05
  Bottom 1.016: L1.P$1 14.61,27.52 14.61,27.15 14.29,26.83 10.79,26.83 C11.+ 6.99,29.05 JP1.1
VCC/2  (via drill 1)
  Top 0.813: v54.45,41.59 54.45,25.56 v72.07,7.94
  Bottom 0.305: 67.47,22.23 67.47,19.68 67.31,19.68
  Bottom 0.406: 67.31,19.68 66.2,18.57 66.2,12.06 68.26,10 U5.16
  Bottom 0.61: C2.1 R6.2 61.42,45.42 61.59,45.24 70.33,45.24 72.07,46.99 U4.16 | C1.1 69.75,9.84 U5.16 | R8.2 72.71,20 70.48,22.23 67.47,22.23
  Bottom 0.813: C2.1 60.24,43.73 59.85,43.34 56.2,43.34 v54.45,41.59 | X5.P$1 72.39,6.83 | 72.39,6.83 70.71,6.83 C1.1 | v72.07,7.94 72.07,7.14 72.39,6.83
(copper drawn outside any net)
  shapes: Bottom circle x4

### Text on the board
Bottom: zzzMariKzzz / 2016 | 2016 | zzzMariKzzz
tNames: OUT | IN | 220V Side | VCC | GND